# Altium schematic sheet MCU.SchDoc
size A3
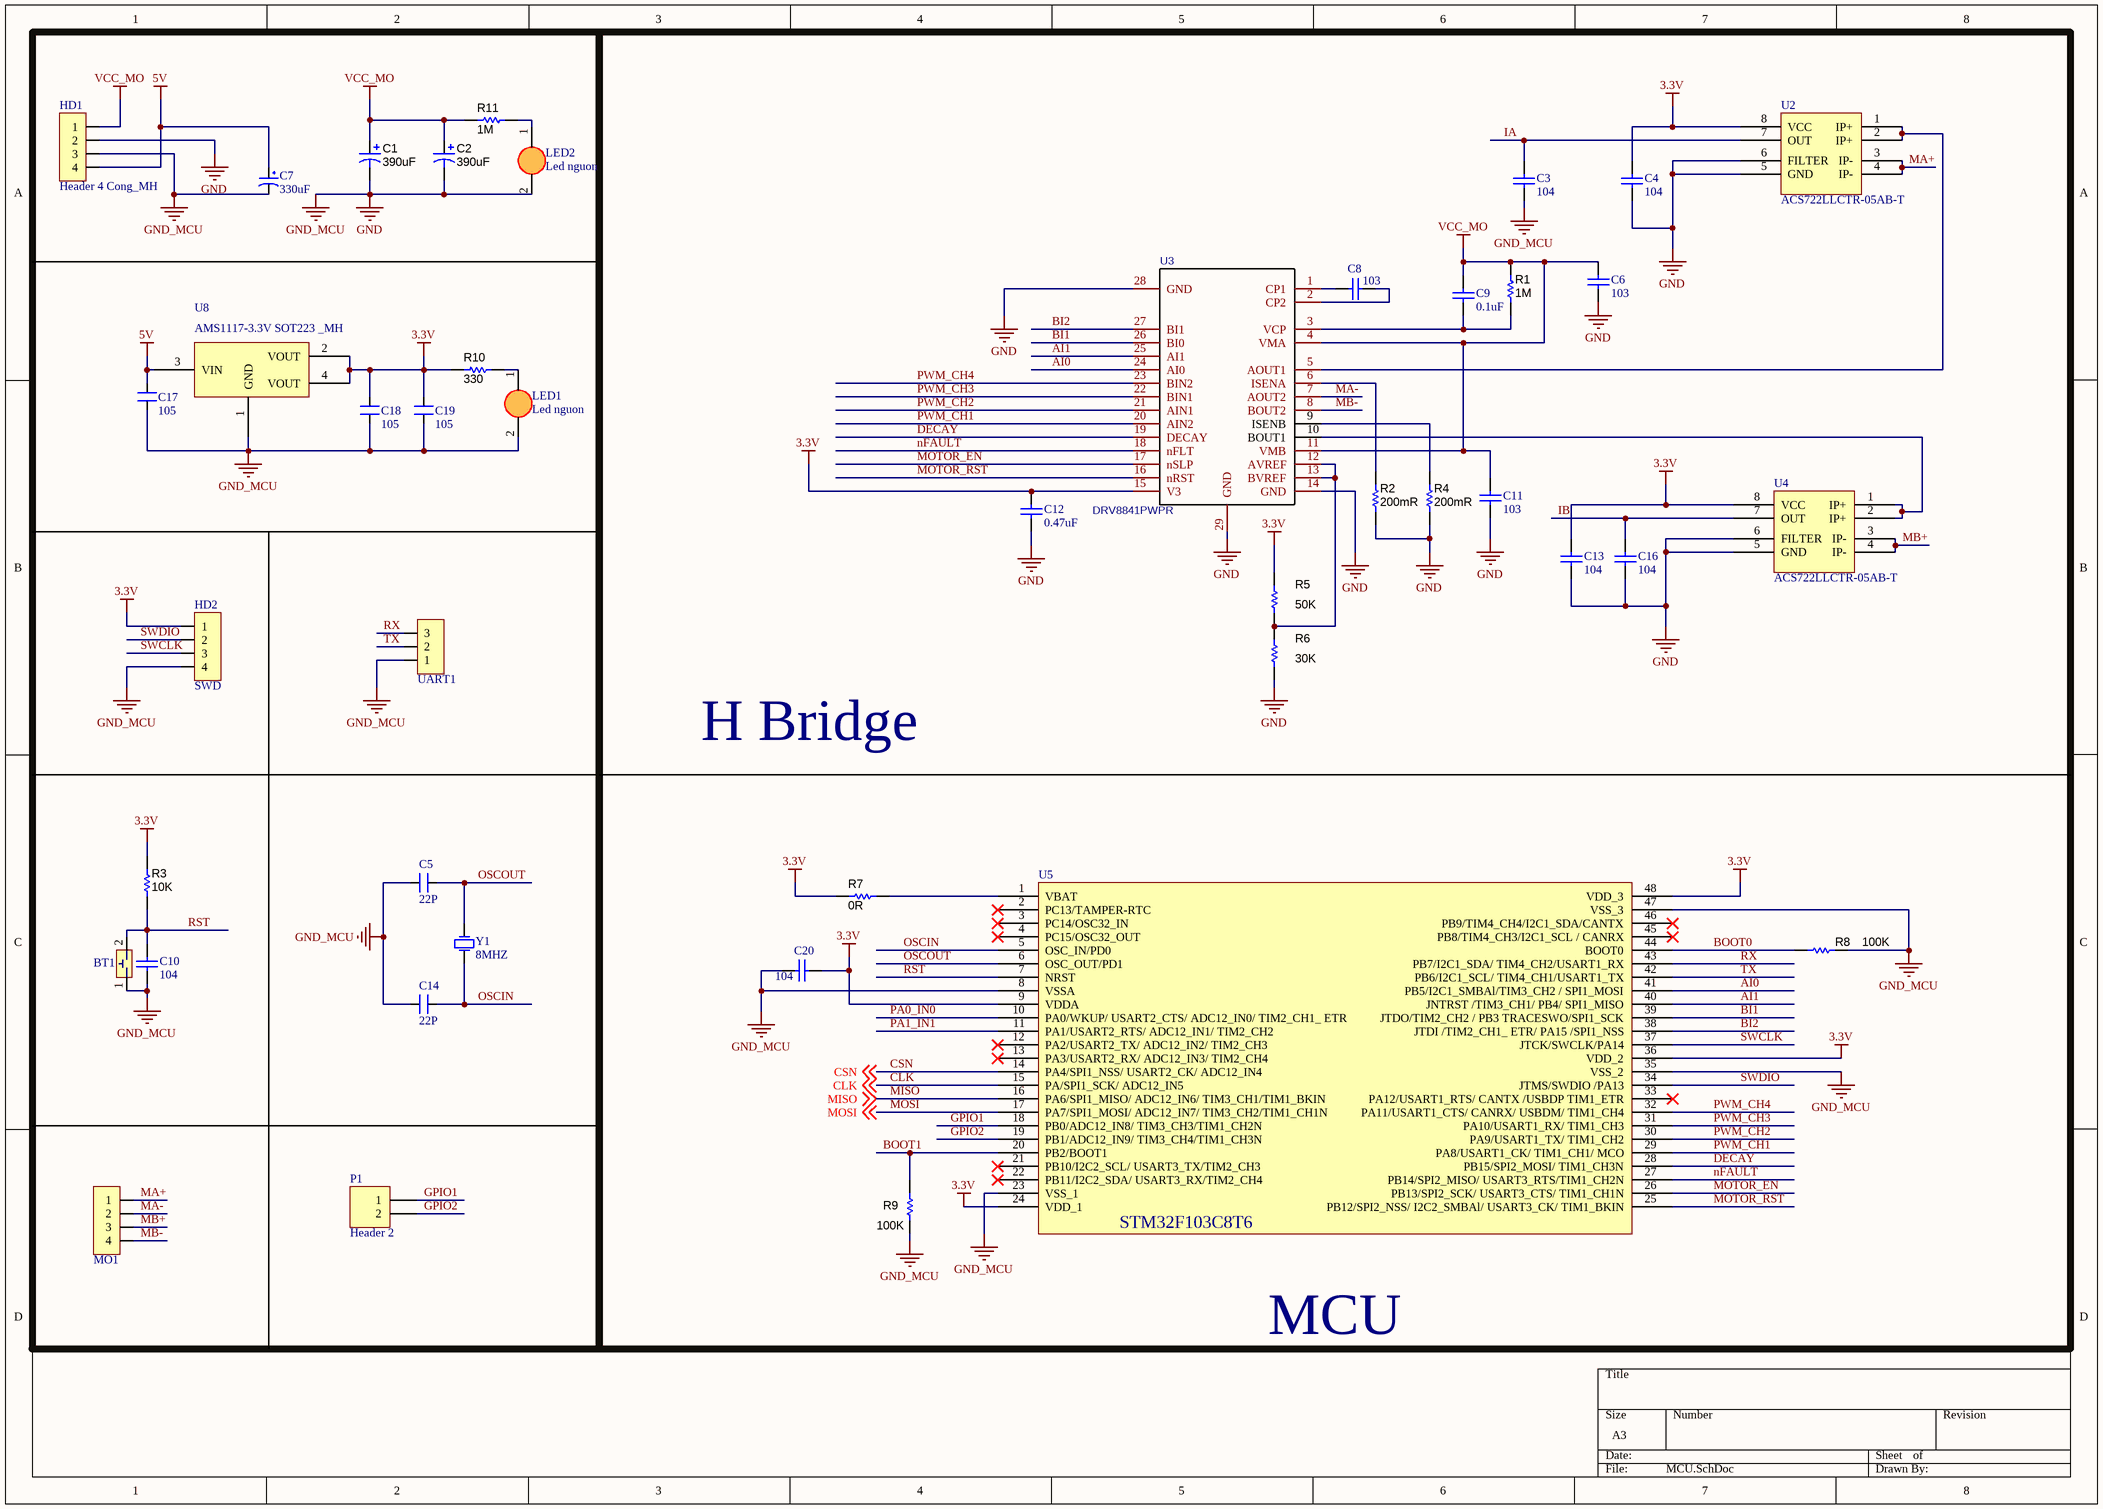
[diagram p0: MCU.SchDoc]

## Parts
BT1  BUTTON 4P SMD_MH  [BUTTON 2P SMD]  (value not drawn)
C1  390uF  [CP1/3.0]
C2  390uF  [CP1/3.0]
C3  104  [0805_HV]
C4  104  [0805_HV]
C5  22P  [0805_HV]
C6  103  [0805_HV]
C7  330uF  [TU_NHOM_220uF_25V_MH]
C8  103  [0805_HV]
C9  0.1uF  [0805_HV]
C10  104  [0805_HV]
C11  103  [0805_HV]
C12  0.47uF  [0805_HV]
C13  104  [0805_HV]
C14  22P  [0805_HV]
C16  104  [0805_HV]
C17  105  [0805_HV]
C18  105  [0805_HV]
C19  105  [0805_HV]
C20  104  [0805_HV]
HD1  Header 4 Cong_MH  [HEADER 4]
HD2  SWD  [HDR1X4]
LED1  Led nguon  [LED_0805]
LED2  Led nguon  [LED_0805]
MO1  Header 4_MH  [HEADER 4]  (value not drawn)
P1  Header 2  [HDR1X2]
R1  1M  [0805_HV]
R2  ValueDisplayed: 200mR  [1210]  (hidden comment: RT0603DRE07140KL)
R3  10K  [0805_HV]
R4  ValueDisplayed: 200mR  [1210]  (hidden comment: RT0603DRE07140KL)
R5  50K  [0805_HV]
R6  30K  [0805_HV]
R7  0R  [0805_HV]
R8  100K  [0805_HV]
R9  100K  [0805_HV]
R10  330  [0805_HV]
R11  1M  [0805_HV]
U2  ACS722LLCTR-05AB-T  [SOP 8]
U3  DRV8841PWPR  [TSSOP-28EP]
U4  ACS722LLCTR-05AB-T  [SOP 8]
U5  STM32F103C8T6 LQFP48 _MH  [LQFP48]  (value not drawn)
U8  AMS1117-3.3V SOT223 _MH  [SOT223]
UART1  Header 3_MH  [HDR1X3]  (value not drawn)
Y1  8MHZ  [XTAL 49S SMD]

## Nets
3.3V: C4.2 C12.2 C13.2 C18.2 C19.2 C20.2 HD2.1 R3.2 R5.2 R7.2 R10.2 U2.8(VCC) U3.15(V3) U4.8(VCC) U5.9(VDDA) U5.24(VDD_1) U5.36(VDD_2) U5.48(VDD_3) U8.2(VOUT) U8.4(VOUT)
5V: C7.1 C17.2 HD1.4 U8.3(VIN)
GND: BT1.1 C1.2(-) C2.2(-) C3.1 C4.1 C5.1 C6.1 C7.2 C10.1 C11.1 C12.1 C13.1 C14.1 C16.1 C17.1 C18.1 C19.1 C20.1 HD1.2 HD1.3 HD2.4 LED1.2(K) LED2.2(K) R2.1 R4.1 R6.1 R8.1 R9.2 U2.5(GND) U2.6(FILTER) U3.14(GND) U3.28(GND) U3.29(GND) U4.5(GND) U4.6(FILTER) U5.8(VSSA) U5.23(VSS_1) U5.35(VSS_2) U5.47(VSS_3) U8.1(GND) UART1.1  [also labelled GND_MCU]
VCC_MO: C1.1(+) C2.1(+) C6.2 C9.2 C11.2 HD1.1 R1.2 R11.2 U3.4(VMA) U3.11(VMB)
AI0: U3.24(AI0) U5.41(PB5/I2C1_SMBAl/TIM3_CH2_/_SPI1_MOSI)
AI1: U3.25(AI1) U5.40(JNTRST_/TIM3_CH1/_PB4/_SPI1_MISO)
BI1: U3.26(BI0) U5.39(JTDO/TIM2_CH2_/_PB3_TRACESWO/SPI1_SCK)
BI2: U3.27(BI1) U5.38(JTDI_/TIM2_CH1__ETR/_PA15_/SPI1_NSS)
BOOT0: R8.2 U5.44(BOOT0)
BOOT1: R9.1 U5.20(PB2/BOOT1)
CLK: U5.15(PA/SPI1_SCK/_ADC12_IN5) ; off-sheet CLK
CSN: U5.14(PA4/SPI1_NSS/_USART2_CK/_ADC12_IN4) ; off-sheet CSN
DECAY: U3.19(DECAY) U5.28(PB15/SPI2_MOSI/_TIM1_CH3N)
GPIO1: P1.1 U5.18(PB0/ADC12_IN8/_TIM3_CH3/TIM1_CH2N)
GPIO2: P1.2 U5.19(PB1/ADC12_IN9/_TIM3_CH4/TIM1_CH3N)
IA: C3.2 U2.7(OUT)
IB: C16.2 U4.7(OUT)
MA+: MO1.1 U2.3(IP-) U2.4(IP-)
MA-: MO1.2 U3.7(AOUT2)
MB+: MO1.3 U4.3(IP-) U4.4(IP-)
MB-: MO1.4 U3.8(BOUT2)
MISO: U5.16(PA6/SPI1_MISO/_ADC12_IN6/_TIM3_CH1/TIM1_BKIN) ; off-sheet MISO
MOSI: U5.17(PA7/SPI1_MOSI/_ADC12_IN7/_TIM3_CH2/TIM1_CH1N) ; off-sheet MOSI
MOTOR_EN: U3.17(nSLP) U5.26(PB13/SPI2_SCK/_USART3_CTS/_TIM1_CH1N)
MOTOR_RST: U3.16(nRST) U5.25(PB12/SPI2_NSS/_I2C2_SMBAl/_USART3_CK/_TIM1_BKIN)
nFAULT: U3.18(nFLT) U5.27(PB14/SPI2_MISO/_USART3_RTS/TIM1_CH2N)
OSCIN: C14.2 U5.5(OSC_IN/PD0) Y1.2(OSC2)
OSCOUT: C5.2 U5.6(OSC_OUT/PD1) Y1.1(OSC1)
PA0_IN0: U5.10(PA0/WKUP/_USART2_CTS/_ADC12_IN0/_TIM2_CH1__ETR)
PA1_IN1: U5.11(PA1/USART2_RTS/_ADC12_IN1/_TIM2_CH2)
PWM_CH1: U3.20(AIN2) U5.29(PA8/USART1_CK/_TIM1_CH1/_MCO)
PWM_CH2: U3.21(AIN1) U5.30(PA9/USART1_TX/_TIM1_CH2)
PWM_CH3: U3.22(BIN1) U5.31(PA10/USART1_RX/_TIM1_CH3)
PWM_CH4: U3.23(BIN2) U5.32(PA11/USART1_CTS/_CANRX/_USBDM/_TIM1_CH4)
RST: BT1.2 C10.2 R3.1 U5.7(NRST)
RX: U5.43(PB7/I2C1_SDA/_TIM4_CH2/USART1_RX) UART1.3
SWCLK: HD2.3 U5.37(JTCK/SWCLK/PA14)
SWDIO: HD2.2 U5.34(JTMS/SWDIO_/PA13)
TX: U5.42(PB6/I2C1_SCL/_TIM4_CH1/USART1_TX) UART1.2
NetC8_1: C8.1 U3.2(CP2)
NetC8_2: C8.2 U3.1(CP1)
NetC9_1: C9.1 R1.1 U3.3(VCP)
NetLED1_1: LED1.1(A) R10.1
NetLED2_1: LED2.1(A) R11.1
NetR2_2: R2.2 U3.6(ISENA)
NetR4_2: R4.2 U3.9(ISENB)
NetR5_1: R5.1 R6.2 U3.12(AVREF) U3.13(BVREF)
NetR7_1: R7.1 U5.1(VBAT)
NetU2_1: U2.1(IP+) U2.2(IP+) U3.5(AOUT1)
NetU3_10: U3.10(BOUT1) U4.1(IP+) U4.2(IP+)

Not connected (* = marked no-connect by the designer): U5 2(PC13/TAMPER-RTC)* 3(PC14/OSC32_IN)* 4(PC15/OSC32_OUT)* 12(PA2/USART2_TX/_ADC12_IN2/_TIM2_CH3)* 13(PA3/USART2_RX/_ADC12_IN3/_TIM2_CH4)* 21(PB10/I2C2_SCL/_USART3_TX/TIM2_CH3)* 22(PB11/I2C2_SDA/_USART3_RX/TIM2_CH4)* 33(PA12/USART1_RTS/_CANTX_/USBDP_TIM1_ETR)* 45(PB8/TIM4_CH3/I2C1_SCL_/_CANRX)* 46(PB9/TIM4_CH4/I2C1_SDA/CANTX)*

## Notes on the sheet
- H Bridge
- MCU
- (in symbol STM32F103C8T6 LQFP48 _MH) STM32F103C8T6

## Library data of the parts
BT1 = BUTTON 4P SMD_MH: Nút nhấn 4 chân, dán
C1 C2 = Capacitor TuHoa: PartNumber: UHW1H391MPD6; Manufacturer: Nichicon; Polarized: Y; U/M: EA; Cap_F: 0.000390; Tolerance_%: 20; Value1: Unknown; VDC_V: 50; Value2: 50V; TaMin_C: -40; TaMax_C: 105; Cap_Case: 10x22; AEC Category: Q200; AEC Qualified: N; CompType: Capacitor; SymbolVersion: 2008-07-09; Value: 390uF; PackageReference: 10x22; RoHS: Y; MountType: TH; Technology: AL; Series: ZL; Publisher: Texas Instruments; LatestRevisionDate: 2015-12-17; ComponentLink1Description: Datasheet link; ComponentLink1URL: http://nichicon-us.com/english/products/pdfs/e-uhw.pdf; Supplier 1: Digi-Key; Supplier Part Number 1: 493-6885-ND; AEC Grade: N/A; ValueDisplayed: 390uF
C3 C4 C6 C8-C13 C16 C20 = Capacitor 0805: Ceramic Chip Capacitor - Standard; Note: Footprint corresponds to dimensions for bulk cassette packaging. This case size has tightened tolerances.; Published: 17-Jul-2002; LatestRevisionDate: 19-Mar-2004; LatestRevisionNote: Silkscreen size reduced.; DatasheetDocument: Mar-2001; PackageDocument: Mar-2001; PackageReference: 0805; Publisher: Altium Limited; Code_JEITA: 0805; Code_IPC: 2012[0805]; ComponentLink1Description: Manufacturer Link; ComponentLink1URL: http://www.kemet.com/; ComponentLink2Description: Datasheet; ComponentLink2URL: http://www.kemet.com/kemet/web/homepage/kechome.nsf/vapubfilesname/F3102TA.pdf/$file/F3102TA.pdf
  C3 C4 C10 C13 C16 C20: Value: 104
  C6 C8 C11: Value: 103
  C9: Value: 0.1uF
  C12: Value: 0.47uF
C5 C14 C17-C19 = CM: Cap SMD; Value: 103
C7 = TU_NHOM_330uF_16V_MH: Value: 47uF/16 - 50V; Description 1: 470uF/6,3V - 330uF/10V - 220uF/16V; Description 2: 100uF/25V - 35V - 47uF/50V - 22uF/100V; Description 3: 33uF => 47uF/63V - 1uF => 4,7uF/160V; Description 4: 1uF => 2,2uF/250V - 1uF/350V
HD1 = Header 4 Cong_MH: Header 4P XH2.54 cong
HD2 MO1 = Header 4_MH: Header 4P XH2.54 thẳng
LED1 LED2 = LED SMD_0805_MH: LED 3mm
P1 = Header 2: Header, 2-Pin; LatestRevisionDate: 17-Jul-2002; LatestRevisionNote: Re-released for DXP Platform.; Publisher: Altium Limited
R1 R3 R5-R11 = R nho: RES, 100, 1%, 0.1 W, 0402; PartNumber: ERJ-2RKF1000X; Manufacturer: Panasonic; CompType: Resistor; Res_ohm: 100; Value_Code: 100R; Tolerance_%: 1; Power_W: 0.1; Value2: 0.1W; VDC_V: 50; TempCo: 100 ppm/C; EIA_Code: E96; U/M: EA; AEC Category: Q200; SymbolVersion: 2009-05-29; PackageReference: 0402; RoHS: Y; Value1: 1%; MountType: SMT; Technology: Thick Film; Published: 2008-06-26; Publisher: Texas Instruments; LatestRevisionDate: 2016-01-08; ComponentLink1Description: Datasheet link; ComponentLink1URL: http://industrial.panasonic.com/www-data/pdf/AOA0000/AOA0000CE2.pdf; Supplier 1: Digi-Key; Supplier Part Number 1: P100LCT-ND; Supplier 2: Mouser; Supplier Part Number 2: 667-ERJ-2RKF1000X; Supplier 3: Farnell; Supplier Part Number 3: 2304034; AEC Qualified: ?
  R1 R11: Value: 1M
  R3: Value: 10K
  R5: Value: 50K
  R6: Value: 30K
  R7: Value: 0R
  R8 R9: Value: 100K
  R10: Value: 330
R2 R4 = RT0603DRE07140KL: RES, 140 k, 0.5%, 0.1 W, 0603; Manufacturer: Yageo America; CompType: Resistor; Value: 140k; Res_ohm: 140000; Tolerance_%: 0.5; Power_W: 0.1; Value2: 0.1W; VDC_V: 75; TempCo: 50 ppm/C; EIA_Code: E192; U/M: EA; SymbolVersion: 2009-05-29; PartNumber: RT0603DRE07140KL; PackageReference: 0603; RoHS: Y; Value_Code: 140k; Value1: 0.5%; MountType: SMT; Technology: Thin Film; Published: 2008-06-26; Publisher: Texas Instruments; LatestRevisionDate: 2014-09-19; ComponentLink1Description: Datasheet link; ComponentLink1URL: http://www.yageo.com/pdf/PYu-RT_1-to-0.05_RoHS_L_3.pdf
U2 U4 = ACS712
U3 = DRV8841PWPR: BOM_Manufacturer: TI; SMT Type: Extend; BOM_Supplier: LCSC; BOM_Manufacturer Part: DRV8841PWPR; image: //image.lceda.cn/szlcsc/C36542.jpg; BOM_Supplier Part: C36542; BOM_LCSC Assembly: Yes; spicePre: U
UART1 = Header 3_MH: Header 3P XH2.54 thẳng
Y1 = CRYSTAL_49S DIP_MH: Crystal Oscillator; Published: 8-Jun-2000; LatestRevisionDate: 17-Jul-2002; LatestRevisionNote: Re-released for DXP Platform.; PackageReference: R38; Publisher: Altium Limited